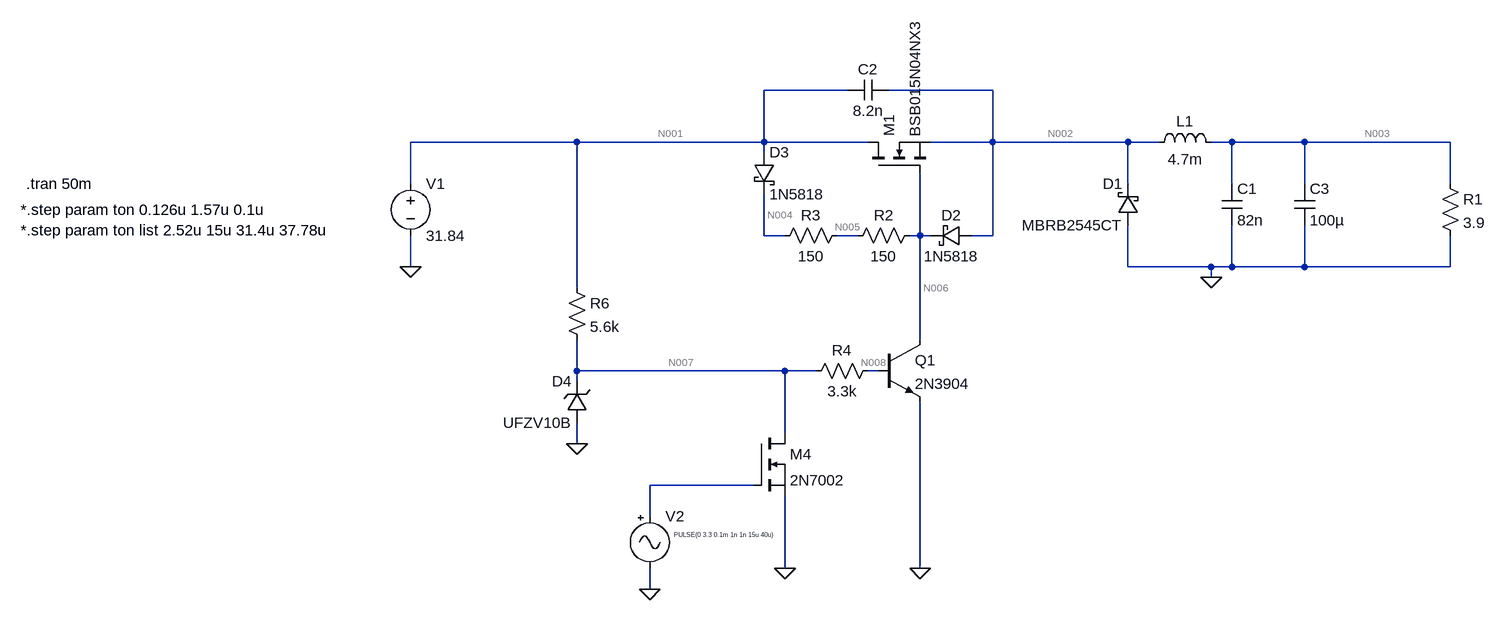
[diagram p0: schematic BuckPrincipal-Bootstrap.asc]
BuckPrincipal-Bootstrap.asc, the LTspice schematic file:
Version 4.1
SHEET 1 1584 680
WIRE 272 -240 144 -240
WIRE 496 -240 336 -240
WIRE -144 -160 -400 -160
WIRE 144 -160 144 -240
WIRE 144 -160 -144 -160
WIRE 304 -160 144 -160
WIRE 496 -160 496 -240
WIRE 496 -160 400 -160
WIRE 704 -160 496 -160
WIRE 752 -160 704 -160
WIRE 864 -160 832 -160
WIRE 976 -160 864 -160
WIRE 1200 -160 976 -160
WIRE 144 -144 144 -160
WIRE -400 -96 -400 -160
WIRE 704 -96 704 -160
WIRE 864 -96 864 -160
WIRE 976 -96 976 -160
WIRE 1200 -96 1200 -160
WIRE 144 -16 144 -80
WIRE 176 -16 144 -16
WIRE 288 -16 256 -16
WIRE 384 -16 384 -112
WIRE 384 -16 368 -16
WIRE 400 -16 384 -16
WIRE 496 -16 496 -160
WIRE 496 -16 464 -16
WIRE -400 32 -400 -16
WIRE 704 32 704 -32
WIRE 832 32 704 32
WIRE 864 32 864 -32
WIRE 864 32 832 32
WIRE 976 32 976 -32
WIRE 976 32 864 32
WIRE 1200 32 1200 -16
WIRE 1200 32 976 32
WIRE 832 48 832 32
WIRE -144 64 -144 -160
WIRE 384 144 384 -16
WIRE -144 192 -144 144
WIRE 176 192 -144 192
WIRE 224 192 176 192
WIRE 320 192 304 192
WIRE -144 208 -144 192
WIRE 176 288 176 192
WIRE -144 304 -144 272
WIRE 128 368 -32 368
WIRE -32 416 -32 368
WIRE 176 496 176 384
WIRE 384 496 384 240
WIRE -32 528 -32 496
FLAG -400 32 0
FLAG 832 48 0
FLAG 384 496 0
FLAG -32 528 0
FLAG 176 496 0
FLAG -144 304 0
SYMBOL voltage -400 -112 R0
WINDOW 123 0 0 Left 0
WINDOW 39 0 0 Left 0
SYMATTR InstName V1
SYMATTR Value 31.84
SYMBOL res 1184 -112 R0
SYMATTR InstName R1
SYMATTR Value 3.9
SYMBOL cap 848 -96 R0
SYMATTR InstName C1
SYMATTR Value 82n
SYMBOL schottky 720 -32 R180
WINDOW 0 24 64 Left 2
WINDOW 3 24 0 Left 2
SYMATTR InstName D1
SYMATTR Value MBRB2545CT
SYMATTR Description Diode
SYMATTR Type diode
SYMBOL ind 736 -144 R270
WINDOW 0 32 56 VTop 2
WINDOW 3 5 56 VBottom 2
SYMATTR InstName L1
SYMATTR Value 4.7m
SYMBOL Misc\\signal -32 400 R0
WINDOW 123 0 0 Left 0
WINDOW 39 0 0 Left 0
WINDOW 3 37 44 Left 0
SYMATTR Value PULSE(0 3.3 0.1m 1n 1n 15u 40u)
SYMATTR InstName V2
SYMBOL nmos 304 -112 R270
SYMATTR InstName M1
SYMATTR Value BSB015N04NX3
SYMBOL schottky 464 -32 R90
WINDOW 0 0 32 VBottom 2
WINDOW 3 32 32 VTop 2
SYMATTR InstName D2
SYMATTR Value 1N5818
SYMATTR Description Diode
SYMATTR Type diode
SYMBOL schottky 128 -144 R0
SYMATTR InstName D3
SYMATTR Value 1N5818
SYMATTR Description Diode
SYMATTR Type diode
SYMBOL res 272 -32 R90
WINDOW 0 0 56 VBottom 2
WINDOW 3 32 56 VTop 2
SYMATTR InstName R3
SYMATTR Value 150
SYMBOL cap 336 -256 R90
WINDOW 0 0 32 VBottom 2
WINDOW 3 32 32 VTop 2
SYMATTR InstName C2
SYMATTR Value 8.2n
SYMBOL npn 320 144 R0
SYMATTR InstName Q1
SYMATTR Value 2N3904
SYMBOL nmos 128 288 R0
SYMATTR InstName M4
SYMATTR Value 2N7002
SYMBOL res 320 176 R90
WINDOW 0 0 56 VBottom 2
WINDOW 3 32 56 VTop 2
SYMATTR InstName R4
SYMATTR Value 3.3k
SYMBOL zener -128 272 R180
WINDOW 0 24 64 Left 2
WINDOW 3 24 0 Left 2
SYMATTR InstName D4
SYMATTR Value UFZV10B
SYMATTR Description Diode
SYMATTR Type diode
SYMBOL res -160 48 R0
SYMATTR InstName R6
SYMATTR Value 5.6k
SYMBOL res 384 -32 R90
WINDOW 0 0 56 VBottom 2
WINDOW 3 32 56 VTop 2
SYMATTR InstName R2
SYMATTR Value 150
SYMBOL cap 960 -96 R0
SYMATTR InstName C3
SYMATTR Value 100µ
TEXT -992 -96 Left 2 !.tran 50m
TEXT -1000 -56 Left 2 !*.step param ton 0.126u 1.57u 0.1u
TEXT -1000 -24 Left 2 !*.step param ton list 2.52u 15u 31.4u 37.78u

The netlist it stands for:
* BuckPrincipal-Bootstrap.asc
V1 N001 0 31.84
R1 N003 0 3.9
C1 N003 0 82n
D1 0 N002 MBRB2545CT
L1 N002 N003 4.7m
V2 N009 0 PULSE(0 3.3 0.1m 1n 1n 15u 40u)
M1 N001 N006 N002 N002 BSB015N04NX3
D2 N002 N006 1N5818
D3 N001 N004 1N5818
R3 N005 N004 150
C2 N002 N001 8.2n
Q1 N006 N008 0 0 2N3904
M4 N007 N009 0 0 2N7002
R4 N008 N007 3.3k
D4 0 N007 UFZV10B
R6 N001 N007 5.6k
R2 N006 N005 150
C3 N003 0 100µ
.model D D
.lib standard.dio
.model NPN NPN
.model PNP PNP
.lib standard.bjt
.model NMOS NMOS
.model PMOS PMOS
.lib standard.mos
.tran 50m
*.step param ton 0.126u 1.57u 0.1u
*.step param ton list 2.52u 15u 31.4u 37.78u
.backanno
.end

* Results of the author's LTspice run, read from the files saved beside the schematic
* Operating Point, zero values left out:
*   V(n003) = 114.9 µV
*   V(n006) = 94.09 mV
*   V(n005) = 15.82 V
*   V(n001) = 31.84 V
*   V(n002) = 114.9 µV
*   V(n004) = 31.55 V
*   V(n008) = 849 mV
*   V(n007) = 9.746 V
*   I(V1) = -108.8 mA
*   Id(M4) = 9.77 pA
*   Is(M4) = -9.77 pA
*   I(R4) = -2.696 mA
*   I(R6) = 3.945 mA
*   I(L1) = 29.45 µA
*   I(D2) = -29.45 µA
*   Id(M1) = 113.9 pA
*   Is(M1) = -113.9 pA
*   I(D3) = 104.8 mA
*   I(R3) = -104.8 mA
*   Ic(Q1) = 104.8 mA
*   Ib(Q1) = 2.696 mA
*   Ie(Q1) = -107.5 mA
*   I(D4) = -1.249 mA
*   I(R2) = -104.8 mA
*   I(R1) = 29.45 µA
*   I(D1) = -117.2 pA